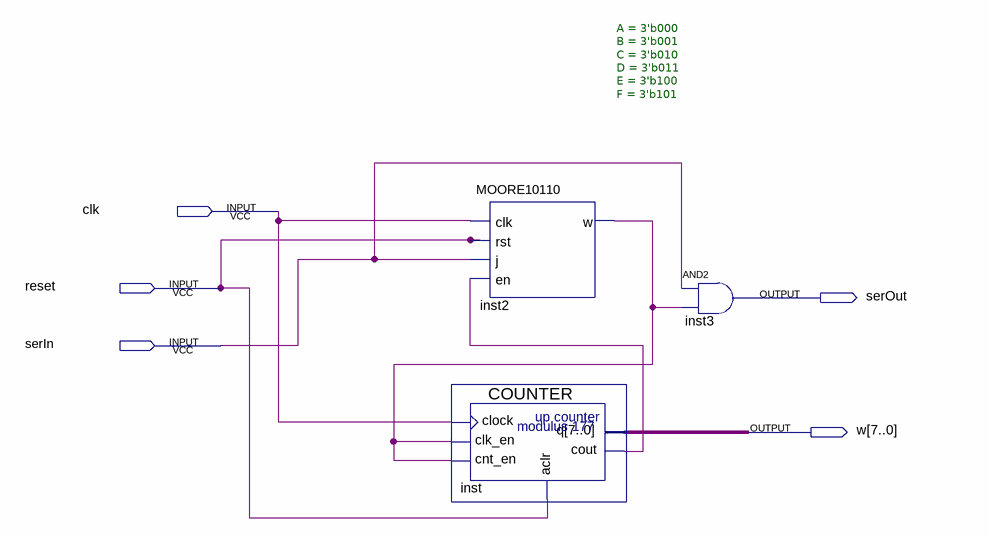
[diagram p0: schematic sheet]
// Quartus schematic E3_QQ.bdf as structural Verilog: 3 symbols, 5 pins
module E3_QQ (
  input  clk,
  input  reset,
  input  serIn,
  output serOut,
  output [7:0] w
);

  wire inst2_w, inst_cout;

  MOORE10110 #(.A(3'b000), .B(3'b001), .C(3'b010), .D(3'b011), .E(3'b100), .F(3'b101)) inst2 (
    .clk(clk), .rst(reset), .j(serIn), .en(inst_cout), .w(inst2_w));
  COUNTER inst (.clock(clk), .clk_en(inst2_w), .cnt_en(inst2_w), .aclr(reset), .cout(inst_cout), .q(w));
  and inst3 (serOut, serIn, inst2_w);
endmodule
